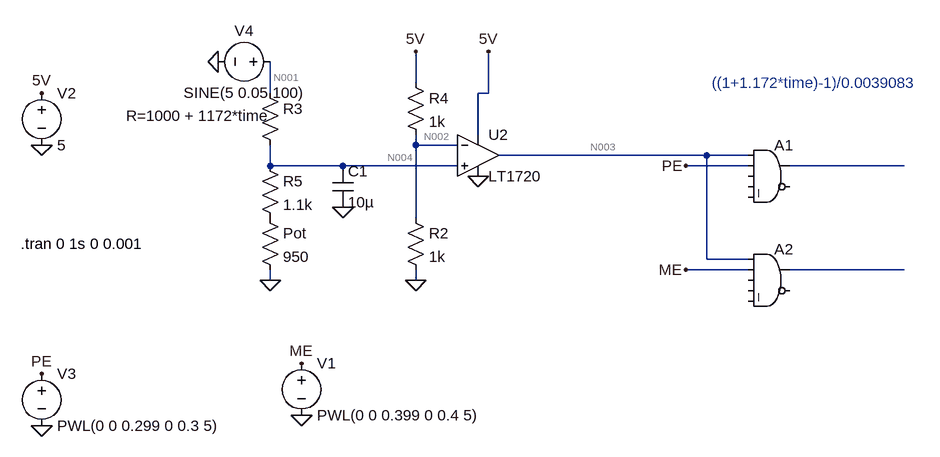
[diagram p0: schematic Test.asc]
Test.asc, the LTspice schematic file:
Version 4
SHEET 1 1004 708
WIRE 176 112 176 64
WIRE -48 128 -48 80
WIRE 288 128 288 64
WIRE 288 128 272 128
WIRE 272 192 272 128
WIRE 176 208 176 192
WIRE 240 208 176 208
WIRE 624 224 304 224
WIRE 688 224 624 224
WIRE -48 240 -48 208
WIRE 64 240 -48 240
WIRE 240 240 64 240
WIRE 688 240 592 240
WIRE 928 240 752 240
WIRE 176 320 176 208
WIRE 624 384 624 224
WIRE 688 384 624 384
WIRE 688 400 592 400
WIRE 928 400 752 400
WIRE -48 416 -48 400
WIRE 176 416 176 400
FLAG -48 416 0
FLAG 288 64 5V
FLAG -400 128 5V
FLAG -400 208 0
FLAG 176 416 0
FLAG 176 64 5V
FLAG 272 256 0
FLAG -400 560 PE
FLAG -400 640 0
FLAG 592 240 PE
FLAG 0 544 ME
FLAG 0 624 0
FLAG 592 400 ME
FLAG 64 304 0
FLAG -128 80 0
SYMBOL res -64 304 R0
SYMATTR InstName Pot
SYMATTR Value 950
SYMBOL voltage -400 112 R0
WINDOW 123 0 0 Left 0
WINDOW 39 0 0 Left 0
SYMATTR InstName V2
SYMATTR Value 5
SYMBOL res -64 112 R0
WINDOW 3 -206 51 Left 2
SYMATTR Value R=1000 + 1172*time
SYMATTR InstName R3
SYMBOL res 160 304 R0
SYMATTR InstName R2
SYMATTR Value 1k
SYMBOL res 160 96 R0
SYMATTR InstName R4
SYMATTR Value 1k
SYMBOL Comparators\\LT1720 272 160 R0
SYMATTR InstName U2
SYMBOL res -64 224 R0
SYMATTR InstName R5
SYMATTR Value 1.1k
SYMBOL Digital\\and 720 192 R0
SYMATTR InstName A1
SYMATTR SpiceLine2 Vhigh=5 Vlow=0 Ref=1.5
SYMBOL voltage -400 544 R0
WINDOW 123 0 0 Left 0
WINDOW 39 0 0 Left 0
SYMATTR InstName V3
SYMATTR Value PWL(0 0 0.299 0 0.3 5)
SYMBOL Digital\\and 720 352 R0
SYMATTR InstName A2
SYMATTR SpiceLine2 Vhigh=5 Vlow=0 Ref=1.5
SYMBOL voltage 0 528 R0
WINDOW 123 0 0 Left 0
WINDOW 39 0 0 Left 0
SYMATTR InstName V1
SYMATTR Value PWL(0 0 0.399 0 0.4 5)
SYMBOL cap 48 240 R0
SYMATTR InstName C1
SYMATTR Value 10µ
SYMBOL voltage -32 80 R90
WINDOW 0 -32 56 VBottom 2
WINDOW 3 32 56 VTop 2
WINDOW 123 0 0 Left 0
WINDOW 39 0 0 Left 0
SYMATTR InstName V4
SYMATTR Value SINE(5 0.05 100)
TEXT -432 360 Left 2 !.tran 0 1s 0 0.001
TEXT 632 112 Left 2 ;((1+1.172*time)-1)/0.0039083

The netlist it stands for:
* Test.asc
R§Pot P001 0 950
V2 5V 0 5
R3 N001 N004 R=1000 + 1172*time
R2 N002 0 1k
R4 5V N002 1k
XU2 N004 N002 5V 0 N003 LT1720  ; pins In+ In- V+ V- OUT
R5 N004 P001 1.1k
A1 N003 PE 0 0 0 0 N005 0 AND Vhigh=5 Vlow=0 Ref=1.5
V3 PE 0 PWL(0 0 0.299 0 0.3 5)
A2 N003 ME 0 0 0 0 N006 0 AND Vhigh=5 Vlow=0 Ref=1.5
V1 ME 0 PWL(0 0 0.399 0 0.4 5)
C1 N004 0 10µ
V4 N001 0 SINE(5 0.05 100)
.tran 0 1s 0 0.001
* ((1+1.172*time)-1)/0.0039083
.lib LT1720.sub
.backanno
.end

* Results of the author's LTspice run, read from the files saved beside the schematic
* Operating Point, zero values left out:
*   V(p001) = 1.557 V
*   V(5v) = 5 V
*   V(n001) = 5 V
*   V(n004) = 3.361 V
*   V(n002) = 2.503 V
*   V(n003) = 4.819 V
*   I(R3) = 1.639 mA
*   I(R5) = 1.639 mA
*   I(R4) = 2.498 mA
*   I(R2) = 2.503 mA
*   I(Pot) = 1.639 mA
*   I(V4) = -1.639 mA
*   I(V2) = -6.498 mA
*   Ix(u2:1) = -100 pA
*   Ix(u2:2) = -5 µA
*   Ix(u2:3) = 4.001 mA
*   Ix(u2:4) = -3.996 mA
*   Ix(u2:5) = -4.647 pA
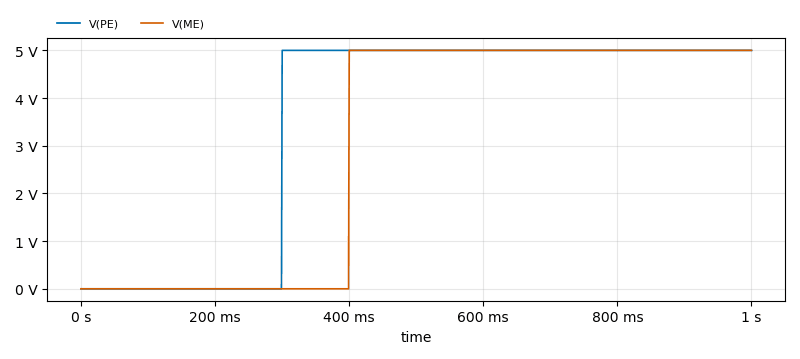
[diagram p1: Transient Analysis of Test.asc, plotted from the saved traces]
* Transient Analysis, 1 run:
*   V(PE): min 0 V, max 5 V, average 3.502 V, rms 4.184 V, last 5 V
*   V(ME): min 0 V, max 5 V, average 3.002 V, rms 3.874 V, last 5 V